# EAGLE schematic PT08ttl3 (EAGLE 6.6.0)

## Sheet 1 of 2
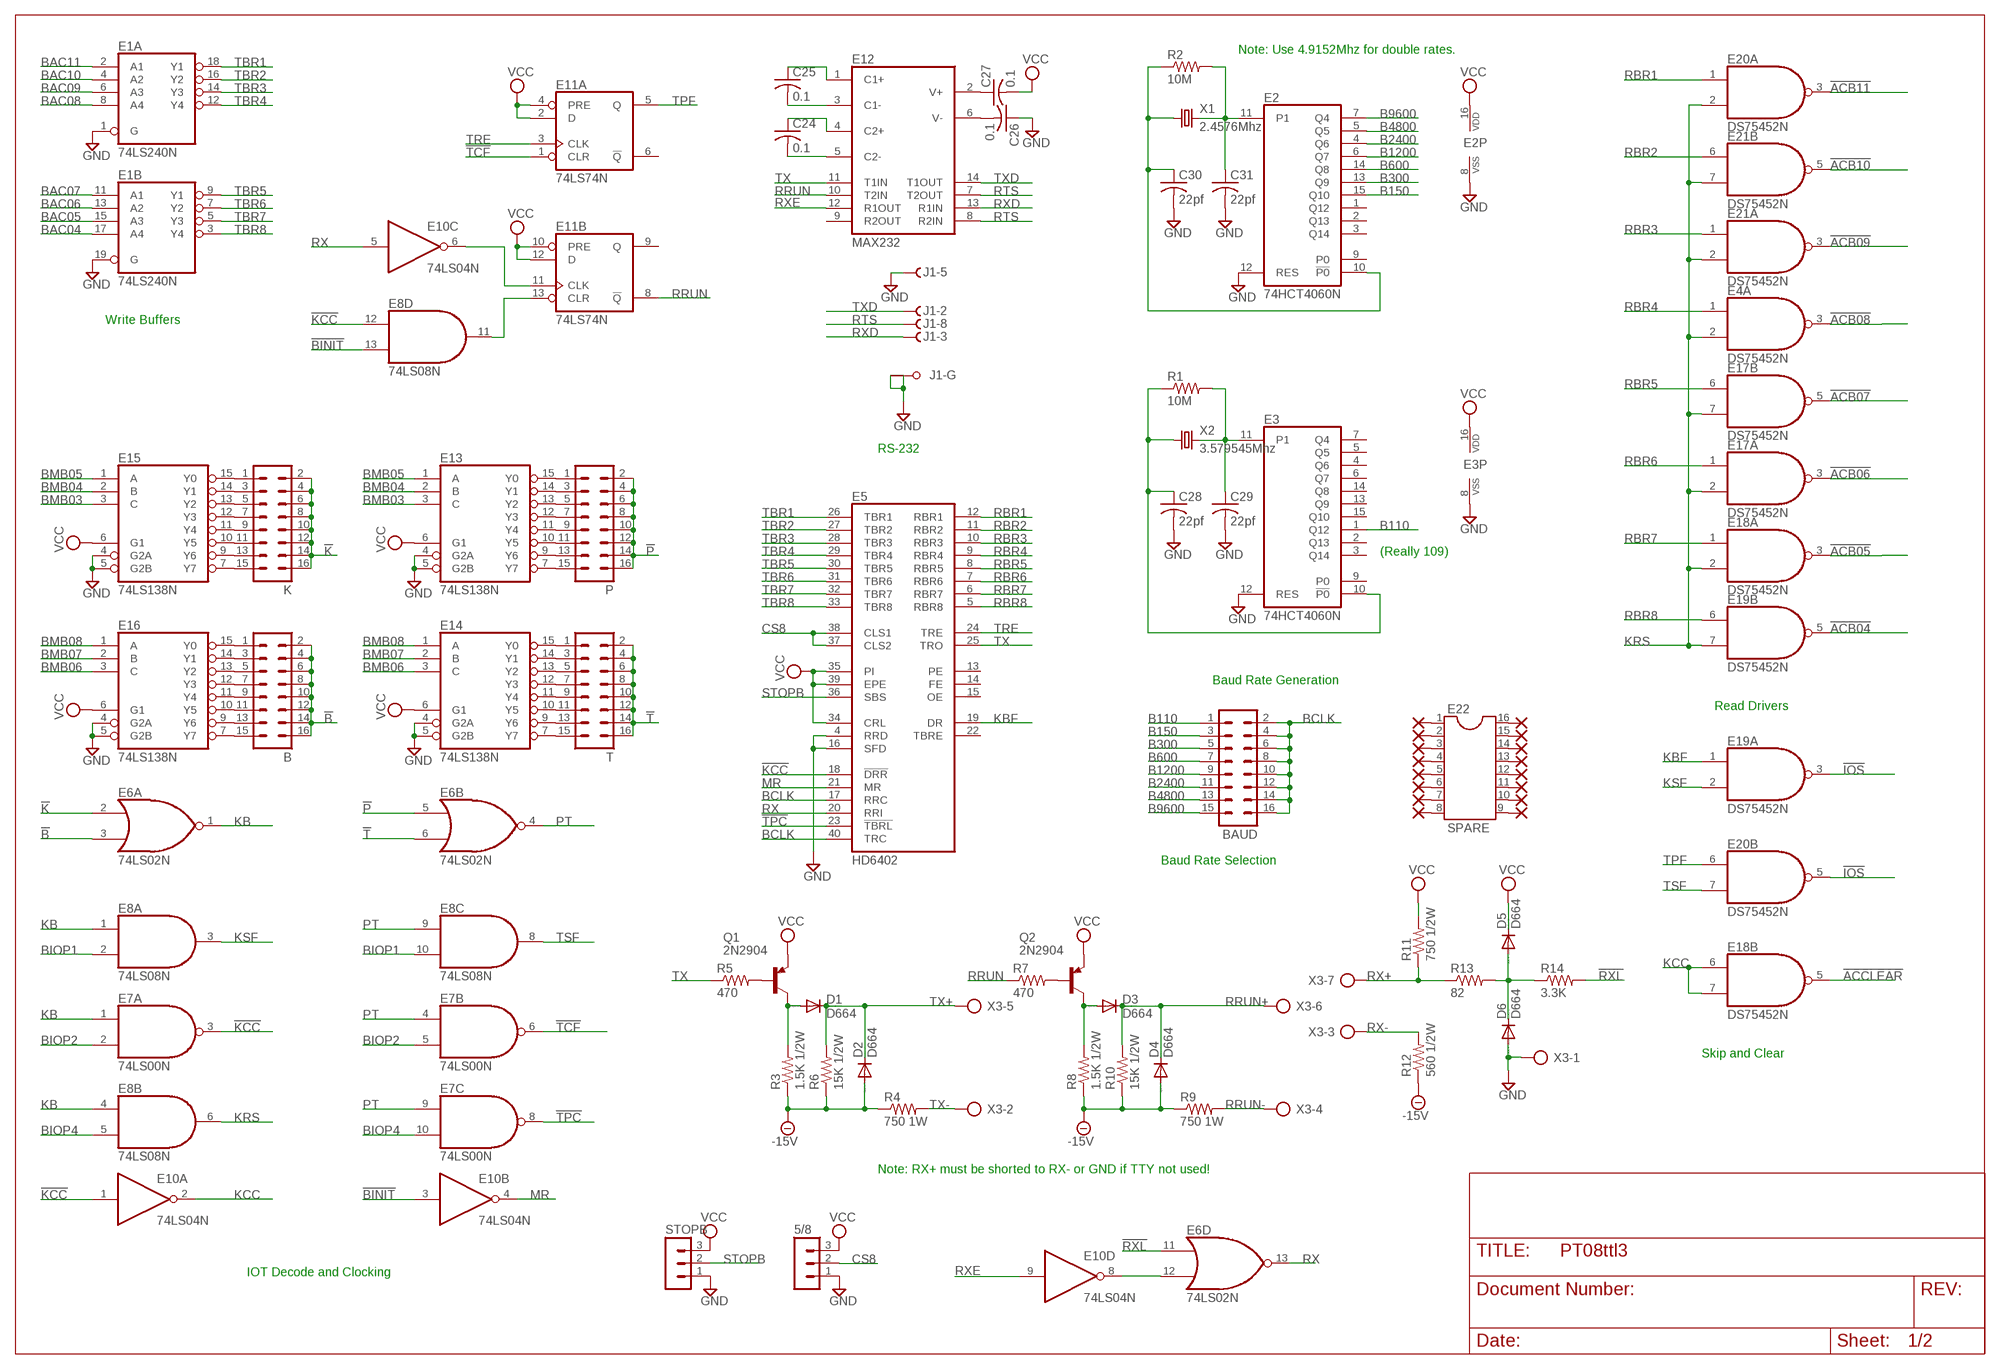
[diagram p0: schematic, sheet 1]

### Parts
5/8  MA03-1  [MA03-1]
B  MA08-2  [MA08-2]
BAUD  MA08-2  [MA08-2]
C24  0.1  C-US050-025X075  [C050-025X075]
C25  0.1  C-US050-025X075  [C050-025X075]
C26  0.1  C-US050-025X075  [C050-025X075]
C27  0.1  C-US050-025X075  [C050-025X075]
C28  22pf  C-US050-025X075  [C050-025X075]
C29  22pf  C-US050-025X075  [C050-025X075]
C30  22pf  C-US050-025X075  [C050-025X075]
C31  22pf  C-US050-025X075  [C050-025X075]
D1  D664  1N4148DO35-10  [DO35-10]
D2  D664  1N4148DO35-10  [DO35-10]
D3  D664  1N4148DO35-10  [DO35-10]
D4  D664  1N4148DO35-10  [DO35-10]
D5  D664  1N4148DO35-10  [DO35-10]
D6  D664  1N4148DO35-10  [DO35-10]
E1  74LS240N  [DIL20]
E2  74HCT4060N  4060N  [DIL16]
E3  74HCT4060N  4060N  [DIL16]
E4  DS75452N  [DIL08]
E5  HD6402  [DIL40]
E6  74LS02N  [DIL14]
E7  74LS00N  [DIL14]
E8  74LS08N  [DIL14]
E10  74LS04N  [DIL14]
E11  74LS74N  [DIL14]
E12  MAX232  [DIL16]
E13  74LS138N  [DIL16]
E14  74LS138N  [DIL16]
E15  74LS138N  [DIL16]
E16  74LS138N  [DIL16]
E17  DS75452N  [DIL08]
E18  DS75452N  [DIL08]
E19  DS75452N  [DIL08]
E20  DS75452N  [DIL08]
E21  DS75452N  [DIL08]
E22  SPARE  DIL16  [DIL16]
J1  F09HPS  [F09HP]
K  MA08-2  [MA08-2]
P  MA08-2  [MA08-2]
PAD18  1,6/0,8  [1,6/0,8]
PAD19  1,6/0,8  [1,6/0,8]
PAD28  1,6/0,8  [1,6/0,8]
PAD29  1,6/0,8  [1,6/0,8]
PAD30  1,6/0,8  [1,6/0,8]
PAD31  1,6/0,8  [1,6/0,8]
PAD32  1,6/0,8  [1,6/0,8]
PAD33  1,6/0,8  [1,6/0,8]
PAD34  1,6/0,8  [1,6/0,8]
PAD35  1,6/0,8  [1,6/0,8]
PAD36  1,6/0,8  [1,6/0,8]
PAD37  1,6/0,8  [1,6/0,8]
PAD38  1,6/0,8  [1,6/0,8]
PAD39  1,6/0,8  [1,6/0,8]
PAD40  1,6/0,8  [1,6/0,8]
PAD41  1,6/0,8  [1,6/0,8]
Q1  2N2904  [TO39]
Q2  2N2904  [TO39]
R1  10M  R-US_0207/10  [0207/10]
R2  10M  R-US_0207/10  [0207/10]
R3  1.5K 1/2W  R-US_0207/10  [0207/10]
R4  750 1W  R-US_0207/10  [0207/10]
R5  470  R-US_0207/10  [0207/10]
R6  15K 1/2W  R-US_0207/10  [0207/10]
R7  470  R-US_0207/10  [0207/10]
R8  1.5K 1/2W  R-US_0207/10  [0207/10]
R9  750 1W  R-US_0207/10  [0207/10]
R10  15K 1/2W  R-US_0207/10  [0207/10]
R11  750 1/2W  R-US_0207/10  [0207/10]
R12  560 1/2W  R-US_0207/10  [0207/10]
R13  82  R-US_0207/10  [0207/10]
R14  3.3K  R-US_0207/10  [0207/10]
STOPB  MA03-1  [MA03-1]
T  MA08-2  [MA08-2]
X1  2.4576Mhz  CRYSTALHC49U-V  [HC49U-V]
X2  3.579545Mhz  CRYSTALHC49U-V  [HC49U-V]
X3  AK300/7  [AK300/7]

### Nets
!ACB04: E19.5(B:O) ; also sheet 2
!ACB05: E18.3(A:O) ; also sheet 2
!ACB06: E17.3(A:O) ; also sheet 2
!ACB07: E17.5(B:O) ; also sheet 2
!ACB08: E4.3(A:O) ; also sheet 2
!ACB09: E21.3(A:O) ; also sheet 2
!ACB10: E21.5(B:O) ; also sheet 2
!ACB11: E20.3(A:O) ; also sheet 2
!ACCLEAR: E18.5(B:O) ; also sheet 2
!B: B.2 B.4 B.6 B.8 B.10 B.12 B.14 B.16 E6.3(A:I1)
!BINIT: E8.13(D:I1) E10.3(B:I) ; also sheet 2
!IOS: E19.3(A:O) E20.5(B:O) ; also sheet 2
!K: E6.2(A:I0) K.2 K.4 K.6 K.8 K.10 K.12 K.14 K.16
!KCC: E5.18(!DRR) E7.3(A:O) E8.12(D:I0) E10.1(A:I)
!P: E6.5(B:I0) P.2 P.4 P.6 P.8 P.10 P.12 P.14 P.16
!RXL: E6.11(D:I0) R14.2
!T: E6.6(B:I1) T.2 T.4 T.6 T.8 T.10 T.12 T.14 T.16
!TCF: E7.6(B:O) E11.1(A:CLR)
!TPC: E5.23(!TBRL) E7.8(C:O)
-15V [supply]: D2.A D4.A R3.1 R4.1 R6.1 R8.1 R9.1 R10.1 R12.1 ; also sheet 2
B110: BAUD.1 E3.1(Q12)
B150: BAUD.3 E2.15(Q10)
B300: BAUD.5 E2.13(Q9)
B600: BAUD.7 E2.14(Q8)
B1200: BAUD.9 E2.6(Q7)
B2400: BAUD.11 E2.4(Q6)
B4800: BAUD.13 E2.5(Q5)
B9600: BAUD.15 E2.7(Q4)
BAC04: E1.17(B:A4) ; also sheet 2
BAC05: E1.15(B:A3) ; also sheet 2
BAC06: E1.13(B:A2) ; also sheet 2
BAC07: E1.11(B:A1) ; also sheet 2
BAC08: E1.8(A:A4) ; also sheet 2
BAC09: E1.6(A:A3) ; also sheet 2
BAC10: E1.4(A:A2) ; also sheet 2
BAC11: E1.2(A:A1) ; also sheet 2
BCLK: BAUD.2 BAUD.4 BAUD.6 BAUD.8 BAUD.10 BAUD.12 BAUD.14 BAUD.16 E5.17(RRC) E5.40(TRC)
BIOP1: E8.2(A:I1) E8.10(C:I1) ; also sheet 2
BIOP2: E7.2(A:I1) E7.5(B:I1) ; also sheet 2
BIOP4: E7.10(C:I1) E8.5(B:I1) ; also sheet 2
BMB03: E13.3(C) E15.3(C) ; also sheet 2
BMB04: E13.2(B) E15.2(B) ; also sheet 2
BMB05: E13.1(A) E15.1(A) ; also sheet 2
BMB06: E14.3(C) E16.3(C) ; also sheet 2
BMB07: E14.2(B) E16.2(B) ; also sheet 2
BMB08: E14.1(A) E16.1(A) ; also sheet 2
CS8: 5/8.2 E5.37(CLS2) E5.38(CLS1)
GND [supply]: 5/8.1 C26.1 C28.2 C29.2 C30.2 C31.2 D6.A E1.1(A:G) E1.19(B:G) E2.8(VSS) E2.12(RES) E3.8(VSS) E3.12(RES) E5.4(RRD) E5.16(SFD) E13.4(G2A) E13.5(G2B) E14.4(G2A) E14.5(G2B) E15.4(G2A) E15.5(G2B) E16.4(G2A) E16.5(G2B) J1.5(-5:F) J1.G1(-G:G1) J1.G2(-G:G2) STOPB.1 X3.1 ; also sheet 2
KB: E6.1(A:O) E7.1(A:I0) E8.1(A:I0) E8.4(B:I0)
KBF: E5.19(DR) E19.1(A:I0) ; also sheet 2
KCC: E10.2(A:O) E18.6(B:I0) E18.7(B:I1)
KRS: E4.2(A:I1) E8.6(B:O) E17.2(A:I1) E17.7(B:I1) E18.2(A:I1) E19.7(B:I1) E20.2(A:I1) E21.2(A:I1) E21.7(B:I1)
KSF: E8.3(A:O) E19.2(A:I1)
MR: E5.21(MR) E10.4(B:O)
N$1: B.13 E16.9(Y6)
N$5: B.1 E16.15(Y0)
N$6: B.3 E16.14(Y1)
N$7: B.5 E16.13(Y2)
N$8: B.7 E16.12(Y3)
N$9: B.9 E16.11(Y4)
N$10: B.11 E16.10(Y5)
N$11: B.15 E16.7(Y7)
N$13: C29.1 E3.11(P1) R1.2 X2.2
N$14: C28.1 E3.10(!P0) R1.1 X2.1
N$15 [supply]: C26.2 E12.6(V-)
N$16 [supply]: C27.1 E12.2(V+)
N$17: Q1.2(B) R5.2
N$18: D1.A Q1.3(C) R3.2
N$19: Q2.2(B) R7.2
N$20: D3.A Q2.3(C) R8.2
N$22: C24.2 E12.5(C2-)
N$23: C30.1 E2.10(!P0) R2.1 X1.1
N$24: D5.A D6.C R13.2 R14.1
N$25: C31.1 E2.11(P1) R2.2 X1.2
N$26: E8.11(D:O) E11.13(B:CLR)
N$27: E6.12(D:I1) E10.8(D:O)
N$29: E10.6(C:O) E11.11(B:CLK)
N$32: C25.2 E12.3(C1-)
N$34: E22.1 PAD18.1(P)
N$41: E22.2 PAD19.1(P)
N$43: E22.3 PAD28.1(P)
N$44: C24.1 E12.4(C2+)
N$45: C25.1 E12.1(C1+)
N$49: E14.15(Y0) T.1
N$50: E22.4 PAD29.1(P)
N$51: E22.5 PAD30.1(P)
N$52: E22.6 PAD31.1(P)
N$53: E22.7 PAD32.1(P)
N$54: E22.8 PAD33.1(P)
N$55: E22.16 PAD34.1(P)
N$56: E22.15 PAD35.1(P)
N$57: E22.14 PAD36.1(P)
N$58: E22.13 PAD37.1(P)
N$59: E22.12 PAD38.1(P)
N$61: E22.11 PAD39.1(P)
N$68: E22.10 PAD40.1(P)
N$69: E22.9 PAD41.1(P)
N$90: E15.15(Y0) K.1
N$91: E15.14(Y1) K.3
N$97: E15.13(Y2) K.5
N$109: E15.12(Y3) K.7
N$112: E15.11(Y4) K.9
N$113: E15.10(Y5) K.11
N$114: E15.7(Y7) K.15
N$115: E15.9(Y6) K.13
N$116: E14.14(Y1) T.3
N$117: E14.13(Y2) T.5
N$118: E14.12(Y3) T.7
N$119: E14.11(Y4) T.9
N$120: E14.10(Y5) T.11
N$121: E14.7(Y7) T.15
N$122: E14.9(Y6) T.13
N$123: E13.15(Y0) P.1
N$124: E13.14(Y1) P.3
N$125: E13.13(Y2) P.5
N$126: E13.12(Y3) P.7
N$127: E13.11(Y4) P.9
N$128: E13.10(Y5) P.11
N$129: E13.7(Y7) P.15
N$130: E13.9(Y6) P.13
PT: E6.4(B:O) E7.4(B:I0) E7.9(C:I0) E8.9(C:I0)
RBR1: E5.12(RBR1) E20.1(A:I0)
RBR2: E5.11(RBR2) E21.6(B:I0)
RBR3: E5.10(RBR3) E21.1(A:I0)
RBR4: E4.1(A:I0) E5.9(RBR4)
RBR5: E5.8(RBR5) E17.6(B:I0)
RBR6: E5.7(RBR6) E17.1(A:I0)
RBR7: E5.6(RBR7) E18.1(A:I0)
RBR8: E5.5(RBR8) E19.6(B:I0)
RRUN: E11.8(B:!Q) E12.10(T2IN) R7.1
RRUN+: D3.C D4.C R10.2 X3.6
RRUN-: R9.2 X3.4
RTS: E12.7(T2OUT) E12.8(R2IN) J1.8(-8:F)
RX: E5.20(RRI) E6.13(D:O) E10.5(C:I)
RX+: R11.1 R13.1 X3.7
RX-: R12.2 X3.3
RXD: E12.13(R1IN) J1.3(-3:F)
RXE: E10.9(D:I) E12.12(R1OUT)
STOPB: E5.36(SBS) STOPB.2
TBR1: E1.18(A:Y1) E5.26(TBR1)
TBR2: E1.16(A:Y2) E5.27(TBR2)
TBR3: E1.14(A:Y3) E5.28(TBR3)
TBR4: E1.12(A:Y4) E5.29(TBR4)
TBR5: E1.9(B:Y1) E5.30(TBR5)
TBR6: E1.7(B:Y2) E5.31(TBR6)
TBR7: E1.5(B:Y3) E5.32(TBR7)
TBR8: E1.3(B:Y4) E5.33(TBR8)
TPF: E11.5(A:Q) E20.6(B:I0) ; also sheet 2
TRE: E5.24(TRE) E11.3(A:CLK)
TSF: E8.8(C:O) E20.7(B:I1)
TX: E5.25(TRO) E12.11(T1IN) R5.1
TX+: D1.C D2.C R6.2 X3.5
TX-: R4.2 X3.2
TXD: E12.14(T1OUT) J1.2(-2:F)
VCC [supply]: 5/8.3 C27.2 D5.C E2.16(VDD) E3.16(VDD) E5.34(CRL) E5.35(PI) E5.39(EPE) E11.2(A:D) E11.4(A:PRE) E11.10(B:PRE) E11.12(B:D) E13.6(G1) E14.6(G1) E15.6(G1) E16.6(G1) Q1.1(E) Q2.1(E) R11.2 STOPB.3 ; also sheet 2
Unconnected: E2.1(Q12) E2.2(Q13) E2.3(Q14) E2.9(P0) E3.2(Q13) E3.3(Q14) E3.4(Q6) E3.5(Q5) E3.6(Q7) E3.7(Q4) E3.9(P0) E3.13(Q9) E3.14(Q8) E3.15(Q10) E5.13(PE) E5.14(FE) E5.15(OE) E5.22(TBRE) E11.6(A:!Q) E11.9(B:Q) E12.9(R2OUT) J1.1(-1:F) J1.4(-4:F) J1.6(-6:F) J1.7(-7:F) J1.9(-9:F)

### Notes on the sheet
- Note: Use 4.9152Mhz for double rates.
- Write Buffers
- RS-232
- (Really 109)
- Baud Rate Generation
- Read Drivers
- Baud Rate Selection
- Skip and Clear
- Note: RX+ must be shorted to RX- or GND if TTY not used!
- IOT Decode and Clocking

## Sheet 2 of 2
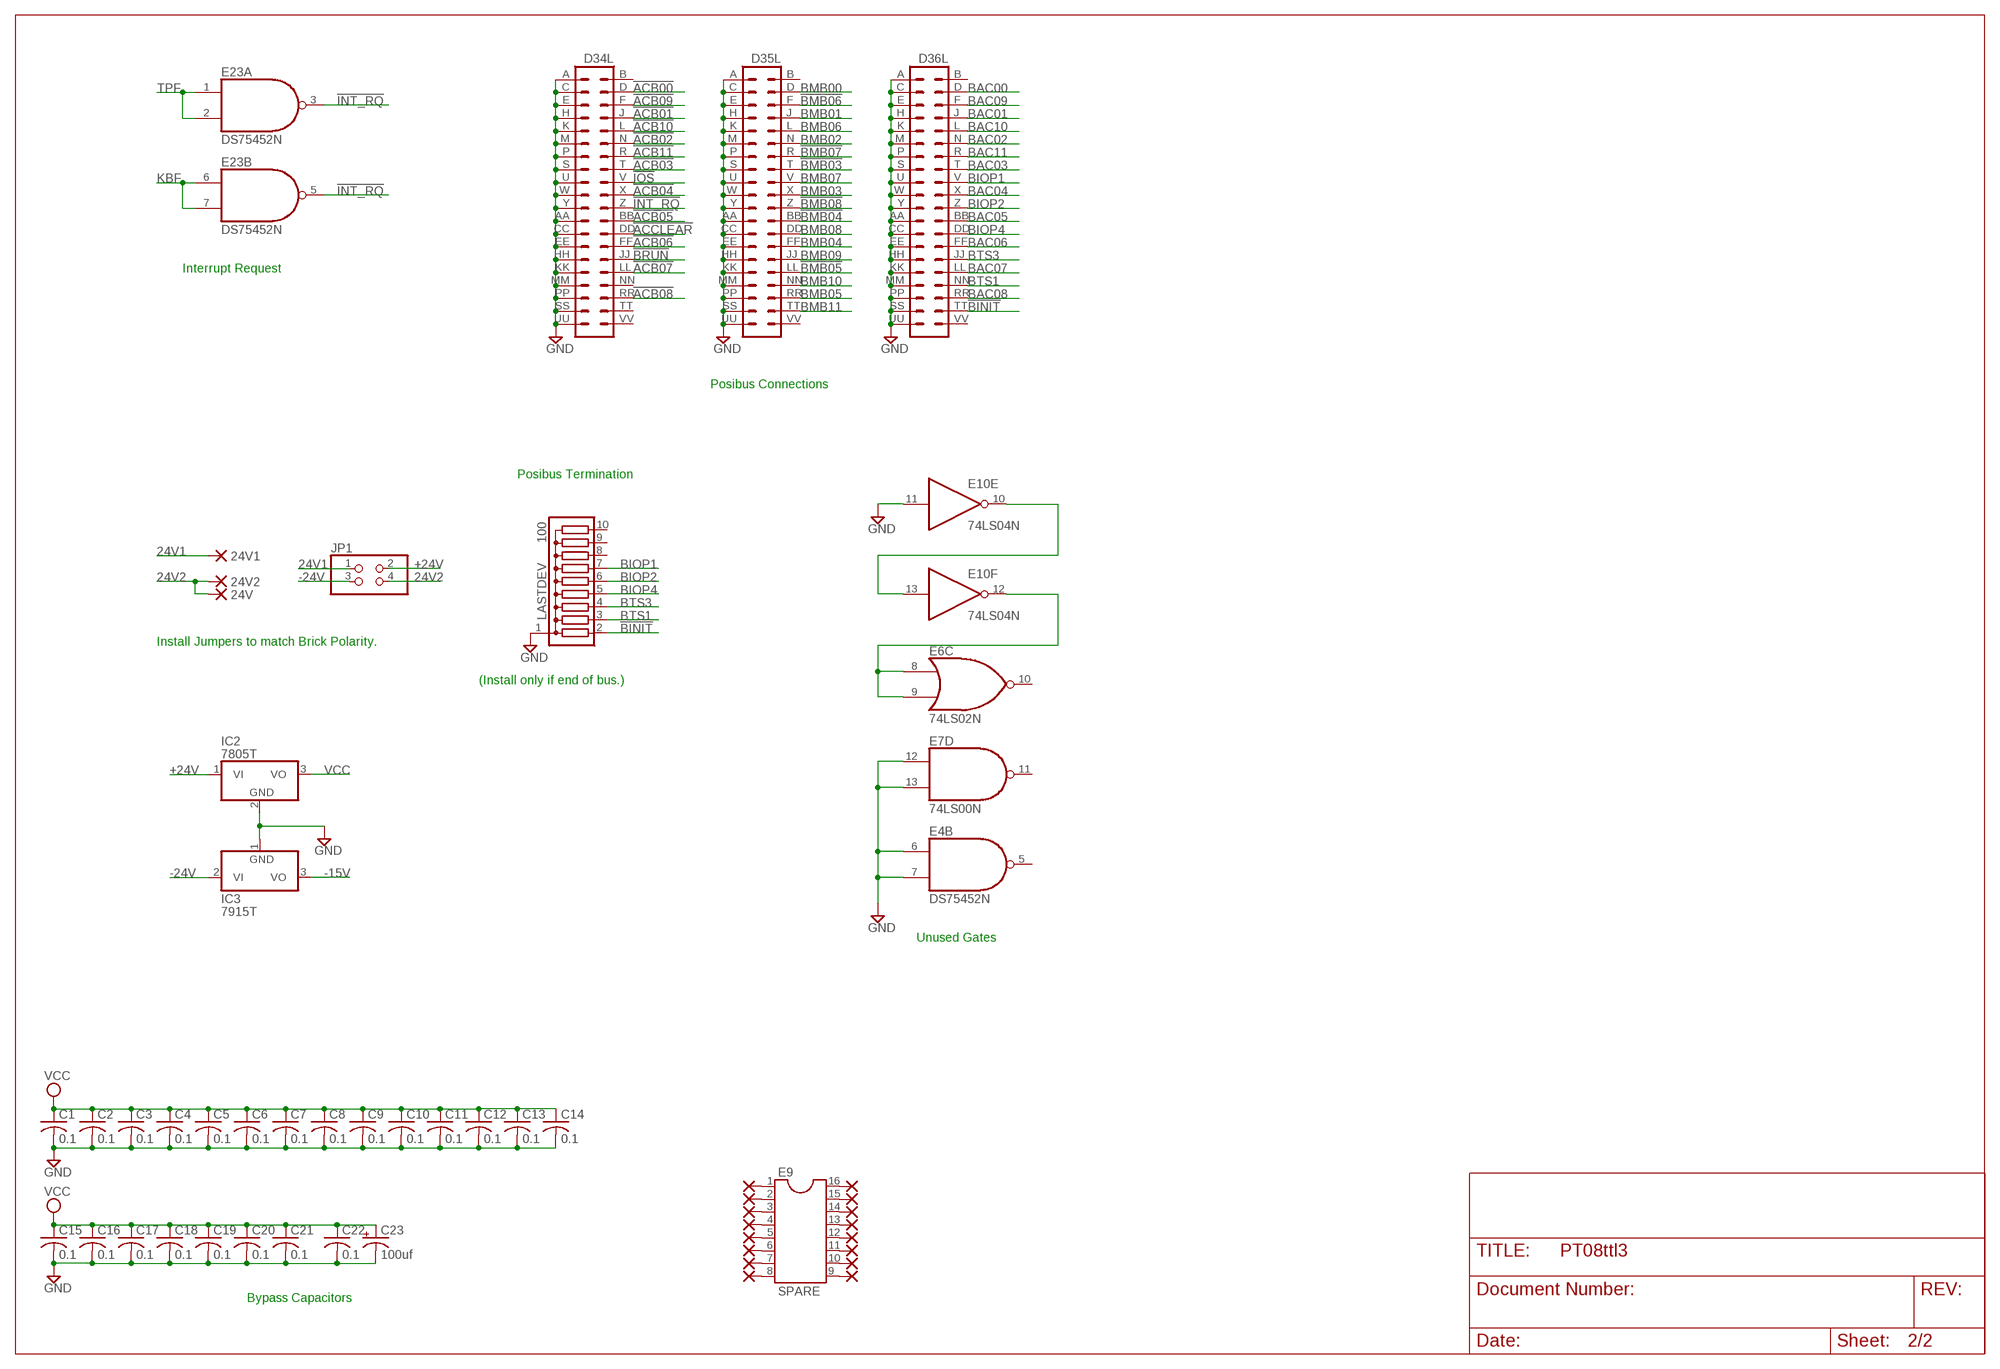
[diagram p1: schematic, sheet 2]

### Parts
24V  PAD-0820  [0820]
24V1  PAD-0820  [0820]
24V2  PAD-0820  [0820]
C1  0.1  C-US050-025X075  [C050-025X075]
C2  0.1  C-US050-025X075  [C050-025X075]
C3  0.1  C-US050-025X075  [C050-025X075]
C4  0.1  C-US050-025X075  [C050-025X075]
C5  0.1  C-US050-025X075  [C050-025X075]
C6  0.1  C-US050-025X075  [C050-025X075]
C7  0.1  C-US050-025X075  [C050-025X075]
C8  0.1  C-US050-025X075  [C050-025X075]
C9  0.1  C-US050-025X075  [C050-025X075]
C10  0.1  C-US050-025X075  [C050-025X075]
C11  0.1  C-US050-025X075  [C050-025X075]
C12  0.1  C-US050-025X075  [C050-025X075]
C13  0.1  C-US050-025X075  [C050-025X075]
C14  0.1  C-US050-025X075  [C050-025X075]
C15  0.1  C-US050-025X075  [C050-025X075]
C16  0.1  C-US050-025X075  [C050-025X075]
C17  0.1  C-US050-025X075  [C050-025X075]
C18  0.1  C-US050-025X075  [C050-025X075]
C19  0.1  C-US050-025X075  [C050-025X075]
C20  0.1  C-US050-025X075  [C050-025X075]
C21  0.1  C-US050-025X075  [C050-025X075]
C22  0.1  C-US050-025X075  [C050-025X075]
C23  100uf  CPOL-USE22-9AXIAL  [E22-9]
D34L  DEC40PINH  [DEC40PINH]
D35L  DEC40PINH  [DEC40PINH]
D36L  DEC40PINH  [DEC40PINH]
E9  SPARE  DIL16  [DIL16]
E23  DS75452N  [DIL08]
IC2  7805T  [TO220H]
IC3  7915T  [TO220H]
JP1  PINHD-2X2  [2X02]
LASTDEV  100  G09R  [SIL10]
PAD1  1,6/0,8  [1,6/0,8]
PAD2  1,6/0,8  [1,6/0,8]
PAD3  1,6/0,8  [1,6/0,8]
PAD4  1,6/0,8  [1,6/0,8]
PAD5  1,6/0,8  [1,6/0,8]
PAD6  1,6/0,8  [1,6/0,8]
PAD7  1,6/0,8  [1,6/0,8]
PAD8  1,6/0,8  [1,6/0,8]
PAD9  1,6/0,8  [1,6/0,8]
PAD42  1,6/0,8  [1,6/0,8]
PAD43  1,6/0,8  [1,6/0,8]
PAD44  1,6/0,8  [1,6/0,8]
PAD45  1,6/0,8  [1,6/0,8]
PAD46  1,6/0,8  [1,6/0,8]
PAD47  1,6/0,8  [1,6/0,8]
PAD48  1,6/0,8  [1,6/0,8]

### Nets
24V1 [supply]: 24V1.P$1(P) JP1.1
24V2 [supply]: 24V2.P$1(P) 24V.P$1(P) JP1.4
!ACB00: D34L.D
!ACB01: D34L.J
!ACB02: D34L.N
!ACB03: D34L.T
!ACB04: D34L.X ; also sheet 1
!ACB05: D34L.BB ; also sheet 1
!ACB06: D34L.FF ; also sheet 1
!ACB07: D34L.LL ; also sheet 1
!ACB08: D34L.RR ; also sheet 1
!ACB09: D34L.F ; also sheet 1
!ACB10: D34L.L ; also sheet 1
!ACB11: D34L.R ; also sheet 1
!ACCLEAR: D34L.DD ; also sheet 1
!BINIT: D36L.TT LASTDEV.2 ; also sheet 1
!BMB03: D35L.T
!BMB04: D35L.BB
!BMB05: D35L.LL
!BMB06: D35L.F
!BMB07: D35L.R
!BMB08: D35L.Z
!BRUN: D34L.JJ
!INT_RQ: D34L.Z E23.3(A:O) E23.5(B:O)
!IOS: D34L.V ; also sheet 1
+24V [supply]: IC2.1(VI) JP1.2
-15V [supply]: IC3.3(VO) ; also sheet 1
-24V [supply]: IC3.2(VI) JP1.3
BAC00: D36L.D
BAC01: D36L.J
BAC02: D36L.N
BAC03: D36L.T
BAC04: D36L.X ; also sheet 1
BAC05: D36L.BB ; also sheet 1
BAC06: D36L.FF ; also sheet 1
BAC07: D36L.LL ; also sheet 1
BAC08: D36L.RR ; also sheet 1
BAC09: D36L.F ; also sheet 1
BAC10: D36L.L ; also sheet 1
BAC11: D36L.R ; also sheet 1
BIOP1: D36L.V LASTDEV.7 ; also sheet 1
BIOP2: D36L.Z LASTDEV.6 ; also sheet 1
BIOP4: D36L.DD LASTDEV.5 ; also sheet 1
BMB00: D35L.D
BMB01: D35L.J
BMB02: D35L.N
BMB03: D35L.X ; also sheet 1
BMB04: D35L.FF ; also sheet 1
BMB05: D35L.RR ; also sheet 1
BMB06: D35L.L ; also sheet 1
BMB07: D35L.V ; also sheet 1
BMB08: D35L.DD ; also sheet 1
BMB09: D35L.JJ
BMB10: D35L.NN
BMB11: D35L.TT
BTS1: D36L.NN LASTDEV.3
BTS3: D36L.JJ LASTDEV.4
GND [supply]: C1.2 C2.2 C3.2 C4.2 C5.2 C6.2 C7.2 C8.2 C9.2 C10.2 C11.2 C12.2 C13.2 C14.2 C15.2 C16.2 C17.2 C18.2 C19.2 C20.2 C21.2 C22.2 C23.- D34L.A D34L.AA D34L.C D34L.CC D34L.E D34L.EE D34L.H D34L.HH D34L.K D34L.KK D34L.M D34L.MM D34L.P D34L.PP D34L.S D34L.SS D34L.U D34L.UU D34L.W D34L.Y D35L.A D35L.AA D35L.C D35L.CC D35L.E D35L.EE D35L.H D35L.HH D35L.K D35L.KK D35L.M D35L.MM D35L.P D35L.PP D35L.S D35L.SS D35L.U D35L.UU D35L.W D35L.Y D36L.A D36L.AA D36L.C D36L.CC D36L.E D36L.EE D36L.H D36L.HH D36L.K D36L.KK D36L.M D36L.MM D36L.P D36L.PP D36L.S D36L.SS D36L.U D36L.UU D36L.W D36L.Y E4.6(B:I0) E4.7(B:I1) E7.12(D:I0) E7.13(D:I1) E10.11(E:I) IC2.2(GND) IC3.1(GND) LASTDEV.1 ; also sheet 1
KBF: E23.6(B:I0) E23.7(B:I1) ; also sheet 1
N$2: E9.1 PAD1.1(P)
N$3: E9.2 PAD2.1(P)
N$4: E9.3 PAD3.1(P)
N$12: E9.4 PAD4.1(P)
N$21: E9.5 PAD5.1(P)
N$30 [supply]: E10.10(E:O) E10.13(F:I)
N$31: E9.6 PAD6.1(P)
N$33: E9.7 PAD7.1(P)
N$35: E9.8 PAD8.1(P)
N$37: E9.16 PAD9.1(P)
N$38: E9.15 PAD42.1(P)
N$39: E9.14 PAD43.1(P)
N$40: E9.13 PAD44.1(P)
N$42: E9.12 PAD45.1(P)
N$46: E9.11 PAD46.1(P)
N$47: E9.10 PAD47.1(P)
N$48: E9.9 PAD48.1(P)
N$60 [supply]: E6.8(C:I0) E6.9(C:I1) E10.12(F:O)
TPF: E23.1(A:I0) E23.2(A:I1) ; also sheet 1
VCC [supply]: C1.1 C2.1 C3.1 C4.1 C5.1 C6.1 C7.1 C8.1 C9.1 C10.1 C11.1 C12.1 C13.1 C14.1 C15.1 C16.1 C17.1 C18.1 C19.1 C20.1 C21.1 C22.1 C23.+ IC2.3(VO) ; also sheet 1
Unconnected: D34L.B D34L.NN D34L.TT D34L.VV D35L.B D35L.VV D36L.B D36L.VV E4.5(B:O) E6.10(C:O) E7.11(D:O) LASTDEV.8 LASTDEV.9 LASTDEV.10

### Notes on the sheet
- Interrupt Request
- Posibus Connections
- Posibus Termination
- Install Jumpers to match Brick Polarity.
- (Install only if end of bus.)
- Unused Gates
- Bypass Capacitors

## Power pins joined to a net without a drawn wire
GND: E1.10(P:GND) E4.4(P:GND) E5.3(GND) E6.7(P:GND) E7.7(P:GND) E8.7(P:GND) E10.7(P:GND) E11.7(P:GND) E12.15(GND) E13.8(GND) E14.8(GND) E15.8(GND) E16.8(GND) E17.4(P:GND) E18.4(P:GND) E19.4(P:GND) E20.4(P:GND) E21.4(P:GND) E23.4(P:GND)
VCC: E1.20(P:VCC) E4.8(P:VCC) E5.1(VCC) E6.14(P:VCC) E7.14(P:VCC) E8.14(P:VCC) E10.14(P:VCC) E11.14(P:VCC) E12.16(VCC) E13.16(VCC) E14.16(VCC) E15.16(VCC) E16.16(VCC) E17.8(P:VCC) E18.8(P:VCC) E19.8(P:VCC) E20.8(P:VCC) E21.8(P:VCC) E23.8(P:VCC)

## Library data of the parts
5/8 STOPB = con-lstb:MA03-1: PIN HEADER; OC_FARNELL: unknown; OC_NEWARK: unknown
24V 24V1 24V2 = dec-con:PAD: WIRE PAD Standard US Drill Sizes
B BAUD K P T = con-lstb:MA08-2: PIN HEADER; OC_FARNELL: unknown; OC_NEWARK: unknown
C1-C22 C24-C31 = rcl:C-US: CAPACITOR, American symbol
C23 = rcl:CPOL-US: POLARIZED CAPACITOR, American symbol
D1-D6 = diode:1N4148: DIODE high speed (Philips)
D34L D35L D36L = dec-con:DEC40PIN: PIN HEADER
E1 = 74xx-us:74*240: Octal BUFFER and LINE DRIVER, 3-state
E2 E3 = 40xx:4060: 14-stage binary/ripple COUNTER
E4 E17-E21 E23 = dec-con:DS75452: Quad 2-input NAND gate, open collector output
E5 = micro-harris:HD6402: MICROCONTROLLER/MEMORY DEVICE; OC_FARNELL: unknown; OC_NEWARK: unknown
E6 = 74xx-us:74*02: Quad 2-input NOR gate
E7 = 74xx-us:74*00: Quad 2-input NAND gate
E8 = 74xx-us:74*08: Quad 2-input AND gate
E9 E22 = ic-package:DIL16: Dual In Line / Socket
E10 = 74xx-us:74*04: Hex INVERTER
E11 = 74xx-us:74*74: Dual D type positive edge triggered FLIP FLOP, preset and clear
E12 = maxim:MAX232: RS232 TRANSCEIVER; MF: MAXIM; MPN: MAX232ACPE+; OC_FARNELL: 9723773; OC_NEWARK: 68K4544
E13-E16 = 74xx-us:74*138: 3-line to 8-line DECODER/DEMULTIPLEXER
IC2 = linear:78*: Positive VOLTAGE REGULATOR Source: http://cache.national.com/ds/LM/LM78L05.pdf http://www.fairchildsemi.com/ds/LM/LM7805.pdf
IC3 = linear:79*: Negative VOLTAGE REGULATOR
J1 = con-subd:F09HPS: SUB-D; OC_FARNELL: unknown; OC_NEWARK: unknown
JP1 = pinhead:PINHD-2X2: PIN HEADER
LASTDEV = resistor-sil:G09R: SIL RESISTOR; OC_FARNELL: unknown; OC_NEWARK: unknown
PAD1-PAD9 PAD18 PAD19 PAD28-PAD48 = wirepad:1,6/0,8: THROUGH-HOLE PAD
Q1 Q2 = transistor-pnp:2N2904*: PNP Transistror
R1-R14 = rcl:R-US_: RESISTOR, American symbol
X1 X2 = crystal:CRYSTAL: CRYSTAL; OC_FARNELL: 1666969; OC_NEWARK: unknown
X3 = con-ptr500:AK300/7: CONNECTOR; OC_FARNELL: unknown; OC_NEWARK: unknown

## Net classes
1 supply: width 0.508 mm